# Altium schematic sheet Boost.SchDoc
size A4
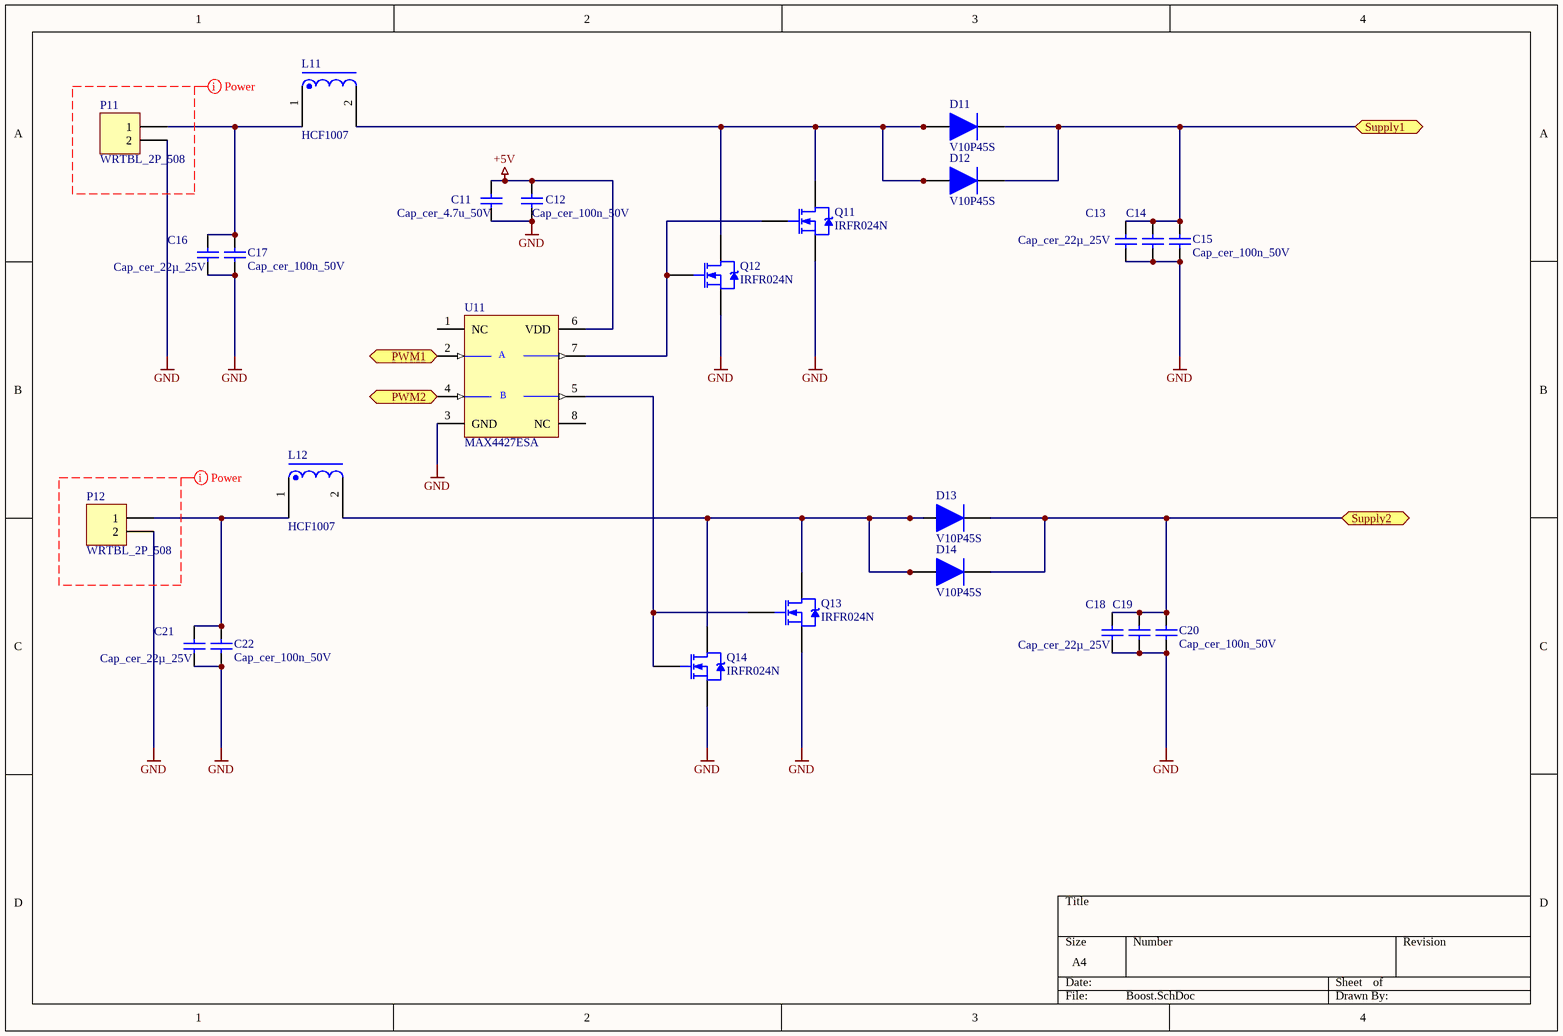
[diagram p0: Boost.SchDoc]

## Parts
C11  Cap_cer_4.7u_50V  [_0805]
C12  Cap_cer_100n_50V  [_0805]
C13  (no value)  [_0805]
C14  Cap_cer_22µ_25V  [_0805]
C15  Cap_cer_100n_50V  [_0805]
C16  Cap_cer_22µ_25V  [_0805]
C17  Cap_cer_100n_50V  [_0805]
C18  Cap_cer_22µ_25V  [_0805]  (value not drawn)
C19  Cap_cer_22µ_25V  [_0805]
C20  Cap_cer_100n_50V  [_0805]
C21  Cap_cer_22µ_25V  [_0805]
C22  Cap_cer_100n_50V  [_0805]
D11  V10P45S  [TO-277A]
D12  V10P45S  [TO-277A]
D13  V10P45S  [TO-277A]
D14  V10P45S  [TO-277A]
L11  HCF1007  [HCF1007]
L12  HCF1007  [HCF1007]
P11  WRTBL_2P_508  [WRTBL_2P_508]
P12  WRTBL_2P_508  [WRTBL_2P_508]
Q11  IRFR024N  [TO-252AA_N]
Q12  IRFR024N  [TO-252AA_N]
Q13  IRFR024N  [TO-252AA_N]
Q14  IRFR024N  [TO-252AA_N]
U11  MAX4427ESA  [NSO8_N]

## Ports
PWM1, PWM2, Supply1, Supply2

## Nets
+5V: C11.2 C12.2 U11.6(VDD)
GND: C11.1 C12.1 C13.1 C14.1 C15.1 C16.1 C17.1 C18.1 C19.1 C20.1 C21.1 C22.1 P11.2 P12.2 Q11.3(S) Q12.3(S) Q13.3(S) Q14.3(S) U11.3(GND)
PWM1: U11.2(INA) ; port PWM1
PWM2: U11.4(INB) ; port PWM2
Supply1: C13.2 C14.2 C15.2 D11.K D12.K ; port Supply1
Supply2: C18.2 C19.2 C20.2 D13.K D14.K ; port Supply2
NetC16_2: C16.2 C17.2 L11.1 P11.1
NetC21_2: C21.2 C22.2 L12.1 P12.1
NetD11_A: D11.A D12.A L11.2 Q11.4(D) Q12.4(D)
NetD13_A: D13.A D14.A L12.2 Q13.4(D) Q14.4(D)
NetQ11_1: Q11.1(G) Q12.1(G) U11.7(OUTA)
NetQ13_1: Q13.1(G) Q14.1(G) U11.5(OUTB)

Not connected (* = marked no-connect by the designer): U11 1(NC) 8(NC)

## Layout directives
net class Power: (no net found under the mark)

## Notes on the sheet
- (in symbol MAX4427ESA) A; B

## Library data of the parts
C11 C12 = Cap_124: QR: 0; Capacity: 4.7u; Voltage: 50V; UID: Cap_124; ComponentLink1URL: #NAME?; mounting: SMD
  C11: Name: Cap_cer_4.7u_50V
  C12: Name: Cap_cer_100n_50V
C13 = Cap_124: Name: Cap_cer_22µ_25V; QR: 0; Capacity: 22µ; Voltage: 25V; UID: Cap_124; ComponentLink1URL: http://at.rs-online.com/web/p/keramik-multilayer-kondensatoren/7900682/; mounting: SMD
C14 C16 C18 C19 C21 = Cap_124: QR: 0; Capacity: 22µ; Voltage: 25V; UID: Cap_124; Name: Cap_cer_22µ_25V; ComponentLink1URL: http://at.rs-online.com/web/p/keramik-multilayer-kondensatoren/7900682/; mounting: SMD
C15 C17 C20 C22 = Cap_124: QR: 0; Capacity: 100n; Voltage: 50V; UID: Cap_124; Name: Cap_cer_100n_50V; ComponentLink1URL: #NAME?; mounting: SMD
D11-D14 = V10P45S: V01P45 Shottky Diode; pin to pad: A>1
L11 L12 = HCF1007: HCF1007 Inductor
P11 P12 = Con_7: RS_number: 193-0586; QR: 0; UID: Con_7; Name: WRTBL_2P_508; Name_Hyperlink: Printklemme 5,08mm 2-polig; ComponentLink1URL: #NAME?; mounting: THT; Pins: 2
Q11-Q14 = IRFR024N: HEXFET N-Channel Power MOSFET; Note: Pin 2 is trimmed and is electrically connected to Drain.; Published: 8-Jun-2000; LatestRevisionDate: 20-Nov-2009; LatestRevisionNote: IPC-7351 Footprint Added.; DatasheetVersion: Apr-1998; PackageVersion: Feb-2003; PackageReference: TO-252AA; Publisher: Altium Limited; PackageDescription: 3-Pin HEXFET Package 2.28 mm Pitch, 9.9 mm Lead Span; Code_JEDEC: TO-252-AA; ComponentLink1Description: Manufacturer Link; ComponentLink1URL: http://www.irf.com/
U11 = MAX4427ESA: Dual High-Speed 1.5A MOSFET Driver; Published: 16-Jan-2001; LatestRevisionDate: 13-Apr-2006; LatestRevisionNote: IPC-7351 Footprint Added.; DatasheetVersion: Mar-1993; PackageReference: NSO8; Publisher: Altium Limited; PackageDescription: 8-Pin Small Outline Integrated Circuit 1.27 mm Pitch; Code_JEDEC: MS-012-AA; Code_IPC: SOIC127P600-8; ComponentLink1Description: Manufacturer Link; ComponentLink1URL: http://www.maxim-ic.com/; ComponentLink2Description: Datasheet; ComponentLink2URL: http://pdfserv.maxim-ic.com/en/ds/MAX4426-MAX4428.pdf